# Altium schematic sheet humidity.SchDoc: Humidity Sensors
size A4; CheckedBy: rrodrigu; Author: Satxo; CompanyName: Satxo; Revision: 0v1; SheetNumber: 4; SheetTotal: 8; ProjectName: Basestation
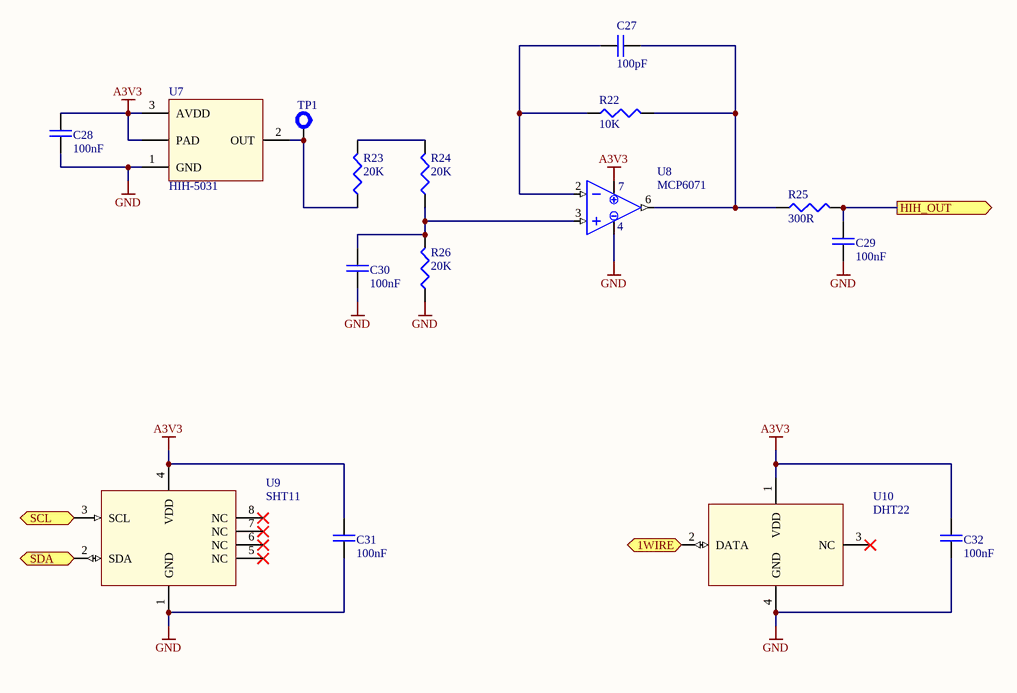
[diagram p0: humidity.SchDoc]

## Parts
C27  100pF  [0603]
C28  100nF  [0603]
C29  100nF  [0603]
C30  100nF  [0603]
C31  100nF  [0603]
C32  100nF  [0603]
R22  10K  [0603]
R23  20K  [0603]
R24  20K  [0603]
R25  300R  [0603]
R26  20K  [0603]
TP1  Test Point  [TERMINAL]  (value not drawn)  (no BOM)
U7  HIH-5031  [HIH]
U8  MCP6071  [SOIC-8]
U9  SHT11  [SHT]
U10  DHT22  [DHT22]

## Ports
1WIRE (bidir), HIH_OUT (out), SCL (in), SDA (bidir)

## Nets
A3V3: C28.2 C31.2 C32.2 U7.3(AVDD) U7.PAD U8.7(VDD) U9.4(VDD) U10.1(VDD)
GND: C28.1 C29.1 C30.1 C31.1 C32.1 R26.1 U7.1(GND) U8.4(VSS) U9.1(GND) U10.4(GND)
1WIRE: U10.2(DATA) ; port 1WIRE
HIH_OUT: C29.2 R25.2 ; port HIH_OUT
SCL: U9.3(SCL) ; port SCL
SDA: U9.2(SDA) ; port SDA
NetC27_1: C27.1 R22.1 U8.2(INN)
NetC27_2: C27.2 R22.2 R25.1 U8.6(VOUT)
NetC30_2: C30.2 R24.1 R26.2 U8.3(INP)
NetR23_1: R23.1 TP1.1(TP) U7.2(OUT)
NetR23_2: R23.2 R24.2

Not connected (* = marked no-connect by the designer): U9 5(NC)* 6(NC)* 7(NC)* 8(NC)*; U10 3(NC)*

## Notes on the sheet
- Title
- Size:
- Date:
- A4
- Number:
- Time:
- Revision:
- Sheet
- of
- File:

## Library data of the parts
C27-C32 = CAP: Capacitor; Owner: Nuno Brum; Sub-Type: Ceramic; Assembly: INS; Maximum Voltage: *; Creation Date: 2005-04-28; Status: Valid; Validation date: 2006-05-15; Type: Capacitor
R22-R26 = RES: Resistor; Owner: Nuno Brum; Sub-Type: Generic; Assembly: INS; Validation date: 2006-05-15; Creation Date: 2002-07-17; Status: Valid; Power: *; Type: Resistor
TP1 = TEST-PROBE: Test/Probe Point; Owner: Nuno Brum; Sub-Type: Mechanical; Assembly: PCB; Validation Date: 2006-05-15; Type: PCB; Creation Date: 2005-06-01; Status: Valid
U7 = HIH-5031: Low Voltage Humidity Sensor; Type: IC; Creation Date: 2012-03-05
U8 = MCP6V26: Low-Offset Opamp; Type: IC; Creation Date: 2012-03-15
U9 = SHT11: Digital Humidity and Temperature Sensor; Type: IC; Creation Date: 2012-12-08
U10 = DHT22: Digital Humidity and Temperature Sensor; Type: IC; Creation Date: 2012-12-09